# EAGLE schematic module (EAGLE 9.3.0)

## Sheet 1 of 5
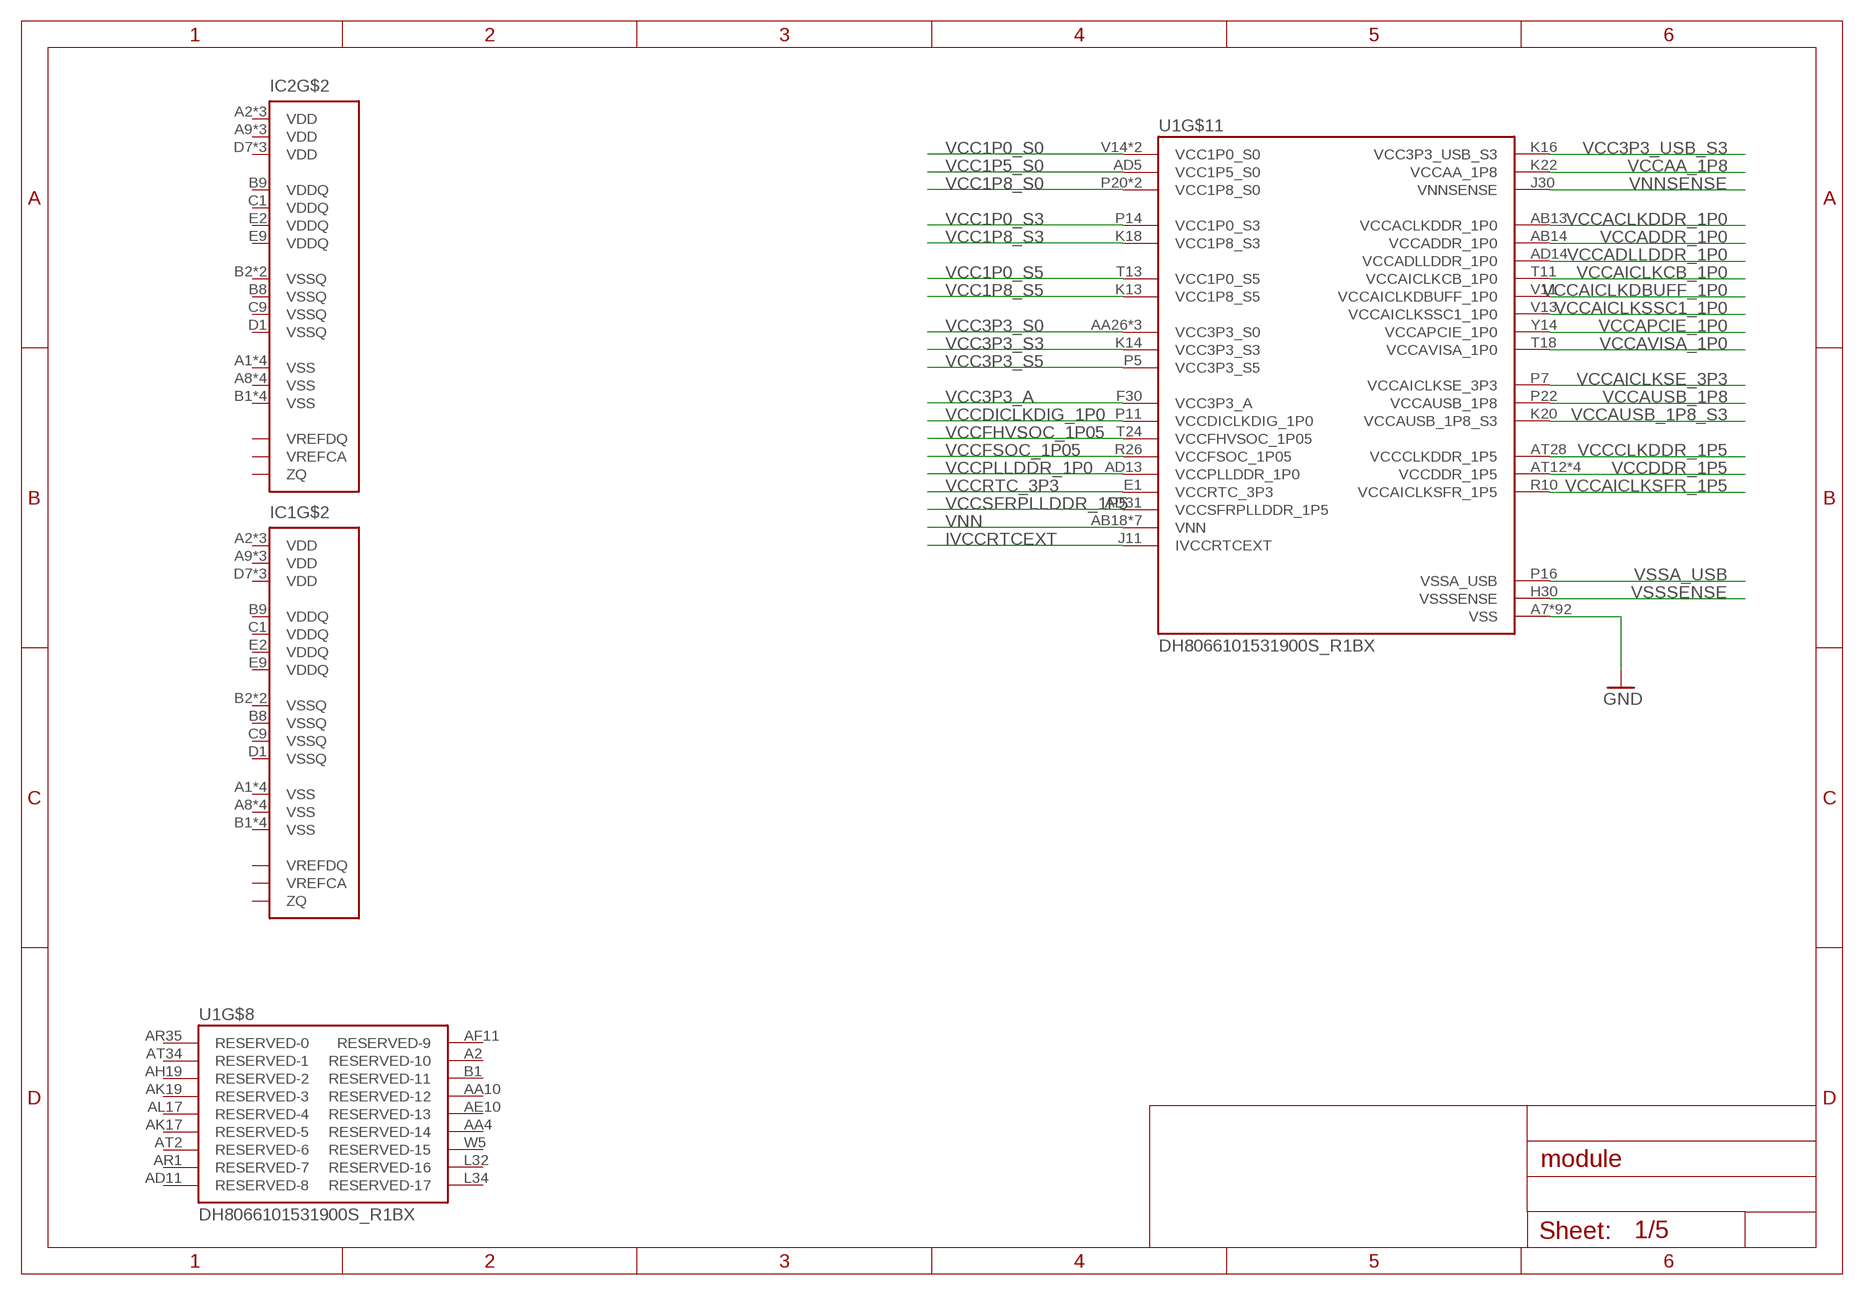
[diagram p0: schematic, sheet 1]

### Parts
IC1  IS43TR82560DL  [FBGA78]
IC2  IS43TR82560DL  [FBGA78]
U1  DH8066101531900S_R1BX  [INTEL_DH8066101531900S_R1BX]

### Nets
GND: U1.A7(VSS) U1.A10(VSS) U1.A12(VSS) U1.A14(VSS) U1.A16(VSS) U1.A18(VSS) U1.A23(VSS) U1.A28(VSS) U1.A31(VSS) U1.A32(VSS) U1.A34(VSS) U1.AB3(VSS) U1.AB11(VSS) U1.AB16(VSS) U1.AB35(VSS) U1.AC2(VSS) U1.AC9(VSS) U1.AC29(VSS) U1.AC30(VSS) U1.AD6(VSS) U1.AD8(VSS) U1.AD16(VSS) U1.AD18(VSS) U1.AD20(VSS) U1.AD35(VSS) U1.AE26(VSS) U1.AF13(VSS) U1.AF20(VSS) U1.AF22(VSS) U1.AF24(VSS) U1.AG1(VSS) U1.AG3(VSS) U1.AH11(VSS) U1.AH17(VSS) U1.AJ35(VSS) U1.AK15(VSS) U1.AK29(VSS) U1.AL6(VSS) U1.AL23(VSS) U1.AM1(VSS) U1.AM4(VSS) U1.AM7(VSS) U1.AM32(VSS) U1.AN9(VSS) U1.AN13(VSS) U1.AN27(VSS) U1.AP2(VSS) U1.AP18(VSS) U1.AP23(VSS) U1.AP33(VSS) U1.AT7(VSS) U1.B29(VSS) U1.B31(VSS) U1.B33(VSS) U1.B35(VSS) U1.C1(VSS) U1.C35(VSS) U1.D5(VSS) U1.D29(VSS) U1.D31(VSS) U1.D33(VSS) U1.E32(VSS) U1.E35(VSS) U1.F6(VSS) U1.F32(VSS) U1.G1(VSS) U1.G12(VSS) U1.H17(VSS) U1.J25(VSS) U1.K35(VSS) U1.M1(VSS) U1.M5(VSS) U1.M11(VSS) U1.M13(VSS) U1.M16(VSS) U1.M22(VSS) U1.M28(VSS) U1.P9(VSS) U1.P13(VSS) U1.P27(VSS) U1.T16(VSS) U1.T22(VSS) U1.U1(VSS) U1.U35(VSS) U1.V9(VSS) U1.V22(VSS) U1.V27(VSS) U1.W1(VSS) U1.W27(VSS) U1.Y11(VSS) U1.Y13(VSS) U1.Y22(VSS) ; also sheet 4,5
IVCCRTCEXT: U1.J11(IVCCRTCEXT)
VCC1P0_S0: U1.V14(VCC1P0_S0) U1.V16(VCC1P0_S0)
VCC1P0_S3: U1.P14(VCC1P0_S3)
VCC1P0_S5: U1.T13(VCC1P0_S5)
VCC1P5_S0: U1.AD5(VCC1P5_S0)
VCC1P8_S0: U1.P20(VCC1P8_S0) U1.T20(VCC1P8_S0)
VCC1P8_S3: U1.K18(VCC1P8_S3)
VCC1P8_S5: U1.K13(VCC1P8_S5)
VCC3P3_A: U1.F30(VCC3P3_A)
VCC3P3_S0: U1.AA26(VCC3P3_S0) U1.AB24(VCC3P3_S0) U1.AD24(VCC3P3_S0)
VCC3P3_S3: U1.K14(VCC3P3_S3)
VCC3P3_S5: U1.P5(VCC3P3_S5)
VCC3P3_USB_S3: U1.K16(VCC3P3_USB_S3)
VCCAA_1P8: U1.K22(VCCAA_1P8)
VCCACLKDDR_1P0: U1.AB13(VCCACLKDDR_1P0)
VCCADDR_1P0: U1.AB14(VCCADDR_1P0)
VCCADLLDDR_1P0: U1.AD14(VCCADLLDDR_1P0)
VCCAICLKCB_1P0: U1.T11(VCCAICLKCB_1P0)
VCCAICLKDBUFF_1P0: U1.V11(VCCAICLKDBUFF_1P0)
VCCAICLKSE_3P3: U1.P7(VCCAICLKSE_3P3)
VCCAICLKSFR_1P5: U1.R10(VCCAICLKSFR_1P5)
VCCAICLKSSC1_1P0: U1.V13(VCCAICLKSSC1_1P0)
VCCAPCIE_1P0: U1.Y14(VCCAPCIE_1P0)
VCCAUSB_1P8: U1.P22(VCCAUSB_1P8)
VCCAUSB_1P8_S3: U1.K20(VCCAUSB_1P8_S3)
VCCAVISA_1P0: U1.T18(VCCAVISA_1P0)
VCCCLKDDR_1P5: U1.AT28(VCCCLKDDR_1P5)
VCCDDR_1P5: U1.AT12(VCCDDR_1P5) U1.AT16(VCCDDR_1P5) U1.AT18(VCCDDR_1P5) U1.AT23(VCCDDR_1P5)
VCCDICLKDIG_1P0: U1.P11(VCCDICLKDIG_1P0)
VCCFHVSOC_1P05: U1.T24(VCCFHVSOC_1P05)
VCCFSOC_1P05: U1.R26(VCCFSOC_1P05)
VCCPLLDDR_1P0: U1.AD13(VCCPLLDDR_1P0)
VCCRTC_3P3: U1.E1(VCCRTC_3P3)
VCCSFRPLLDDR_1P5: U1.AD31(VCCSFRPLLDDR_1P5)
VNN: U1.AB18(VNN) U1.AB20(VNN) U1.V18(VNN) U1.V20(VNN) U1.Y16(VNN) U1.Y18(VNN) U1.Y20(VNN)
VNNSENSE: U1.J30(VNNSENSE)
VSSA_USB: U1.P16(VSSA_USB)
VSSSENSE: U1.H30(VSSSENSE)
Unconnected: IC1.E1(VREFDQ) IC1.H8(ZQ) IC1.J8(VREFCA) IC2.E1(VREFDQ) IC2.H8(ZQ) IC2.J8(VREFCA) U1.A2(RESERVED-10) U1.AA4(RESERVED-14) U1.AA10(RESERVED-12) U1.AD11(RESERVED-8) U1.AE10(RESERVED-13) U1.AF11(RESERVED-9) U1.AH19(RESERVED-2) U1.AK17(RESERVED-5) U1.AK19(RESERVED-3) U1.AL17(RESERVED-4) U1.AR1(RESERVED-7) U1.AR35(RESERVED-0) U1.AT2(RESERVED-6) U1.AT34(RESERVED-1) U1.B1(RESERVED-11) U1.L32(RESERVED-16) U1.L34(RESERVED-17) U1.W5(RESERVED-15)

## Sheet 2 of 5
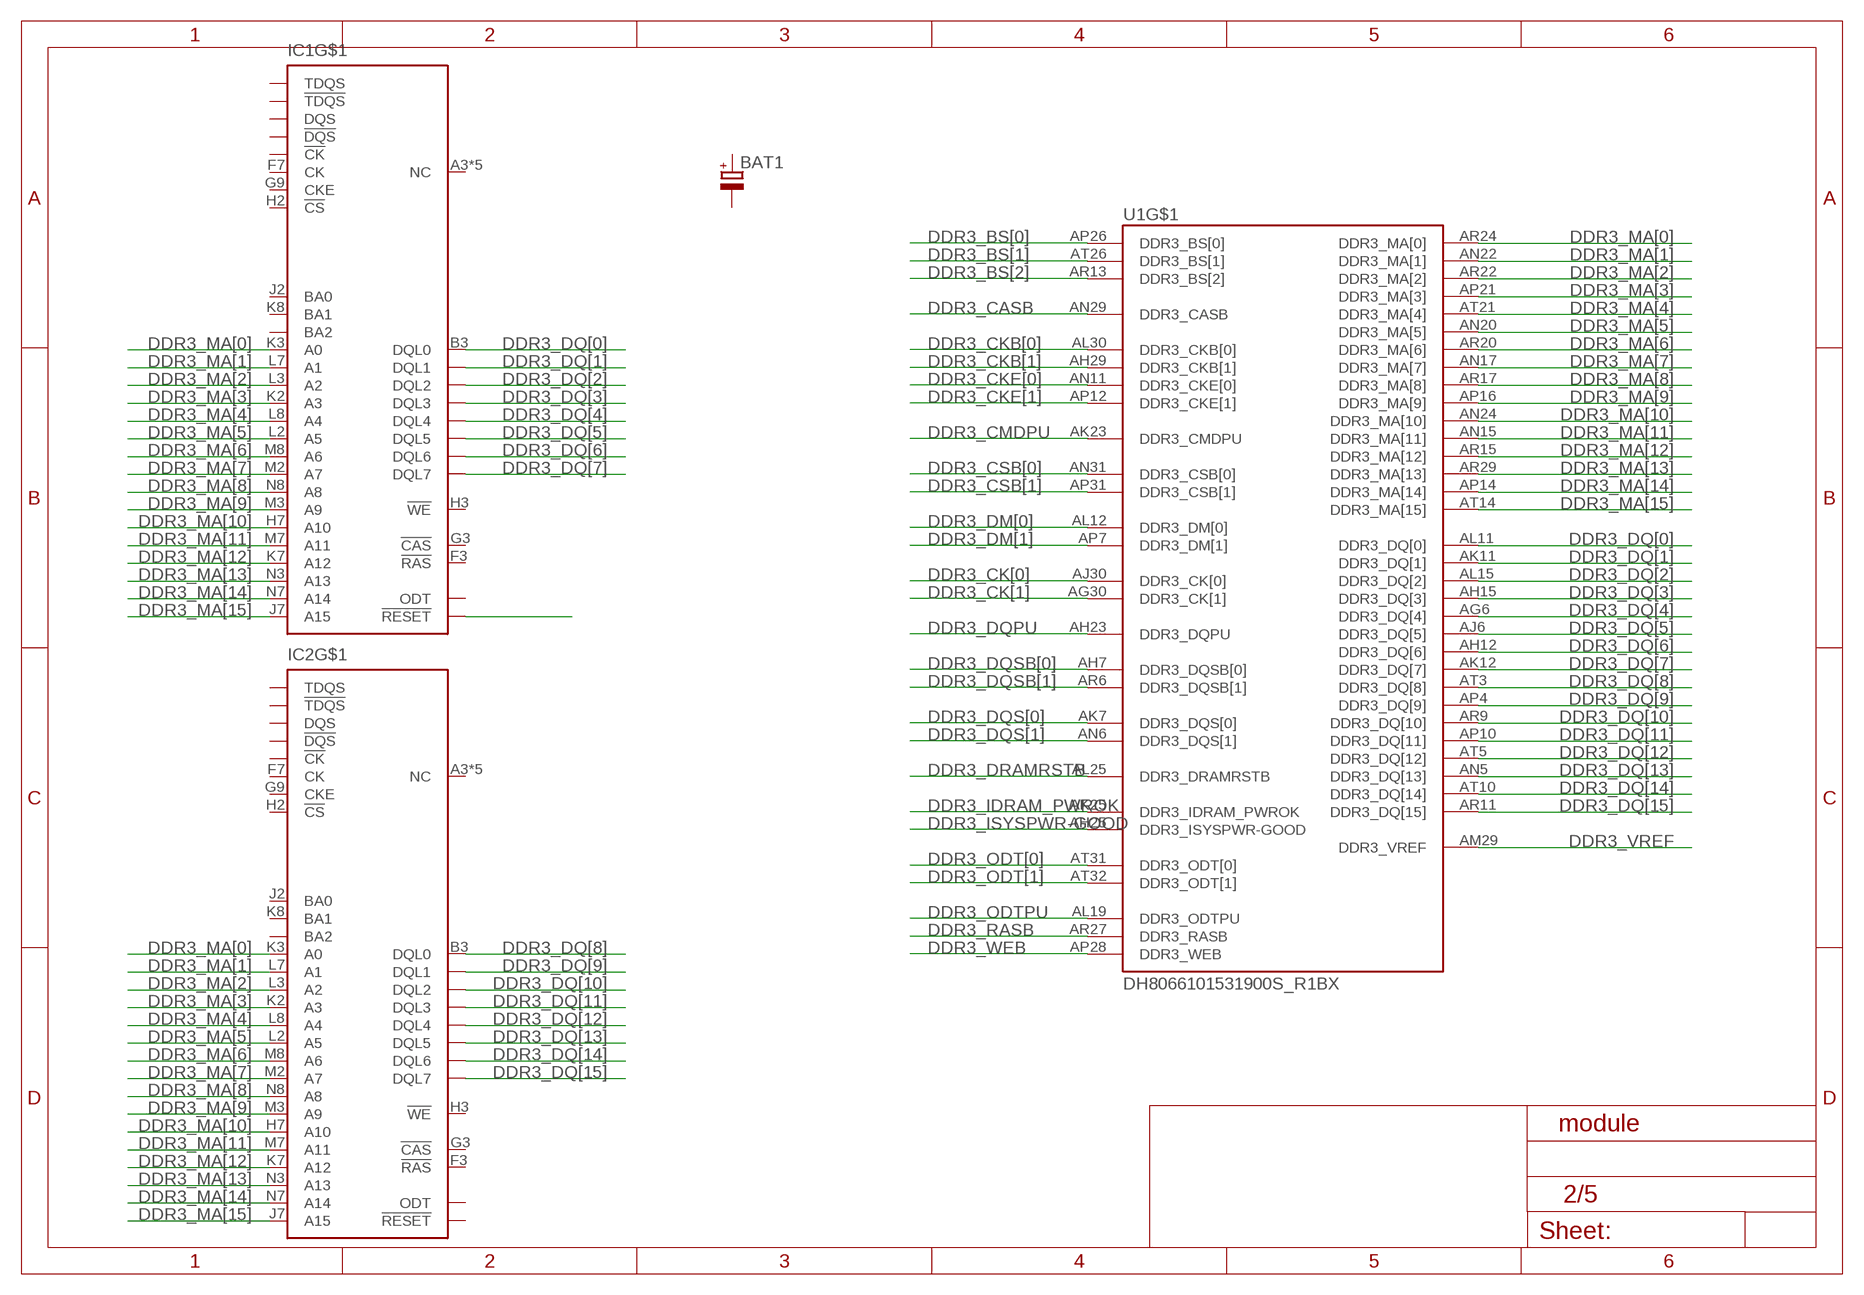
[diagram p1: schematic, sheet 2]

### Parts
BAT1  DCK-3R3E224U-E  [621]

### Nets
DDR3_BS[0]: U1.AP26(DDR3_BS[0])
DDR3_BS[1]: U1.AT26(DDR3_BS[1])
DDR3_BS[2]: U1.AR13(DDR3_BS[2])
DDR3_CASB: U1.AN29(DDR3_CASB)
DDR3_CK[0]: U1.AJ30(DDR3_CK[0])
DDR3_CK[1]: U1.AG30(DDR3_CK[1])
DDR3_CKB[0]: U1.AL30(DDR3_CKB[0])
DDR3_CKB[1]: U1.AH29(DDR3_CKB[1])
DDR3_CKE[0]: U1.AN11(DDR3_CKE[0])
DDR3_CKE[1]: U1.AP12(DDR3_CKE[1])
DDR3_CMDPU: U1.AK23(DDR3_CMDPU)
DDR3_CSB[0]: U1.AN31(DDR3_CSB[0])
DDR3_CSB[1]: U1.AP31(DDR3_CSB[1])
DDR3_DM[0]: U1.AL12(DDR3_DM[0])
DDR3_DM[1]: U1.AP7(DDR3_DM[1])
DDR3_DQ[0]: IC1.B3(DQL0) U1.AL11(DDR3_DQ[0])
DDR3_DQ[1]: IC1.C7(DQL1) U1.AK11(DDR3_DQ[1])
DDR3_DQ[2]: IC1.C2(DQL2) U1.AL15(DDR3_DQ[2])
DDR3_DQ[3]: IC1.C8(DQL3) U1.AH15(DDR3_DQ[3])
DDR3_DQ[4]: IC1.E3(DQL4) U1.AG6(DDR3_DQ[4])
DDR3_DQ[5]: IC1.E8(DQL5) U1.AJ6(DDR3_DQ[5])
DDR3_DQ[6]: IC1.D2(DQL6) U1.AH12(DDR3_DQ[6])
DDR3_DQ[7]: IC1.E7(DQL7) U1.AK12(DDR3_DQ[7])
DDR3_DQ[8]: IC2.B3(DQL0) U1.AT3(DDR3_DQ[8])
DDR3_DQ[9]: IC2.C7(DQL1) U1.AP4(DDR3_DQ[9])
DDR3_DQ[10]: IC2.C2(DQL2) U1.AR9(DDR3_DQ[10])
DDR3_DQ[11]: IC2.C8(DQL3) U1.AP10(DDR3_DQ[11])
DDR3_DQ[12]: IC2.E3(DQL4) U1.AT5(DDR3_DQ[12])
DDR3_DQ[13]: IC2.E8(DQL5) U1.AN5(DDR3_DQ[13])
DDR3_DQ[14]: IC2.D2(DQL6) U1.AT10(DDR3_DQ[14])
DDR3_DQ[15]: IC2.E7(DQL7) U1.AR11(DDR3_DQ[15])
DDR3_DQPU: U1.AH23(DDR3_DQPU)
DDR3_DQS[0]: U1.AK7(DDR3_DQS[0])
DDR3_DQS[1]: U1.AN6(DDR3_DQS[1])
DDR3_DQSB[0]: U1.AH7(DDR3_DQSB[0])
DDR3_DQSB[1]: U1.AR6(DDR3_DQSB[1])
DDR3_DRAMRSTB: U1.AL25(DDR3_DRAMRSTB)
DDR3_IDRAM_PWROK: U1.AK25(DDR3_IDRAM_PWROK)
DDR3_ISYSPWR-GOOD: U1.AH25(DDR3_ISYSPWR-GOOD)
DDR3_MA[0]: IC1.K3(A0) IC2.K3(A0) U1.AR24(DDR3_MA[0])
DDR3_MA[1]: IC1.L7(A1) IC2.L7(A1) U1.AN22(DDR3_MA[1])
DDR3_MA[2]: IC1.L3(A2) IC2.L3(A2) U1.AR22(DDR3_MA[2])
DDR3_MA[3]: IC1.K2(A3) IC2.K2(A3) U1.AP21(DDR3_MA[3])
DDR3_MA[4]: IC1.L8(A4) IC2.L8(A4) U1.AT21(DDR3_MA[4])
DDR3_MA[5]: IC1.L2(A5) IC2.L2(A5) U1.AN20(DDR3_MA[5])
DDR3_MA[6]: IC1.M8(A6) IC2.M8(A6) U1.AR20(DDR3_MA[6])
DDR3_MA[7]: IC1.M2(A7) IC2.M2(A7) U1.AN17(DDR3_MA[7])
DDR3_MA[8]: IC1.N8(A8) IC2.N8(A8) U1.AR17(DDR3_MA[8])
DDR3_MA[9]: IC1.M3(A9) IC2.M3(A9) U1.AP16(DDR3_MA[9])
DDR3_MA[10]: IC1.H7(A10) IC2.H7(A10) U1.AN24(DDR3_MA[10])
DDR3_MA[11]: IC1.M7(A11) IC2.M7(A11) U1.AN15(DDR3_MA[11])
DDR3_MA[12]: IC1.K7(A12) IC2.K7(A12) U1.AR15(DDR3_MA[12])
DDR3_MA[13]: IC1.N3(A13) IC2.N3(A13) U1.AR29(DDR3_MA[13])
DDR3_MA[14]: IC1.N7(A14) IC2.N7(A14) U1.AP14(DDR3_MA[14])
DDR3_MA[15]: IC1.J7(A15) IC2.J7(A15) U1.AT14(DDR3_MA[15])
DDR3_ODT[0]: U1.AT31(DDR3_ODT[0])
DDR3_ODT[1]: U1.AT32(DDR3_ODT[1])
DDR3_ODTPU: U1.AL19(DDR3_ODTPU)
DDR3_RASB: U1.AR27(DDR3_RASB)
DDR3_VREF: U1.AM29(DDR3_VREF)
DDR3_WEB: U1.AP28(DDR3_WEB)
N$1: IC1.N2(!RESET)
Unconnected: BAT1.+ BAT1.- IC1.A3(NC) IC1.A7(!TDQS) IC1.B7(TDQS) IC1.C3(DQS) IC1.D3(!DQS) IC1.F1(NC) IC1.F3(!RAS) IC1.F7(CK) IC1.F9(NC) IC1.G1(ODT) IC1.G3(!CAS) IC1.G7(!CK) IC1.G9(CKE) IC1.H1(NC) IC1.H2(!CS) IC1.H3(!WE) IC1.H9(NC) IC1.J2(BA0) IC1.J3(BA2) IC1.K8(BA1) IC2.A3(NC) IC2.A7(!TDQS) IC2.B7(TDQS) IC2.C3(DQS) IC2.D3(!DQS) IC2.F1(NC) IC2.F3(!RAS) IC2.F7(CK) IC2.F9(NC) IC2.G1(ODT) IC2.G3(!CAS) IC2.G7(!CK) IC2.G9(CKE) IC2.H1(NC) IC2.H2(!CS) IC2.H3(!WE) IC2.H9(NC) IC2.J2(BA0) IC2.J3(BA2) IC2.K8(BA1) IC2.N2(!RESET)

## Sheet 3 of 5
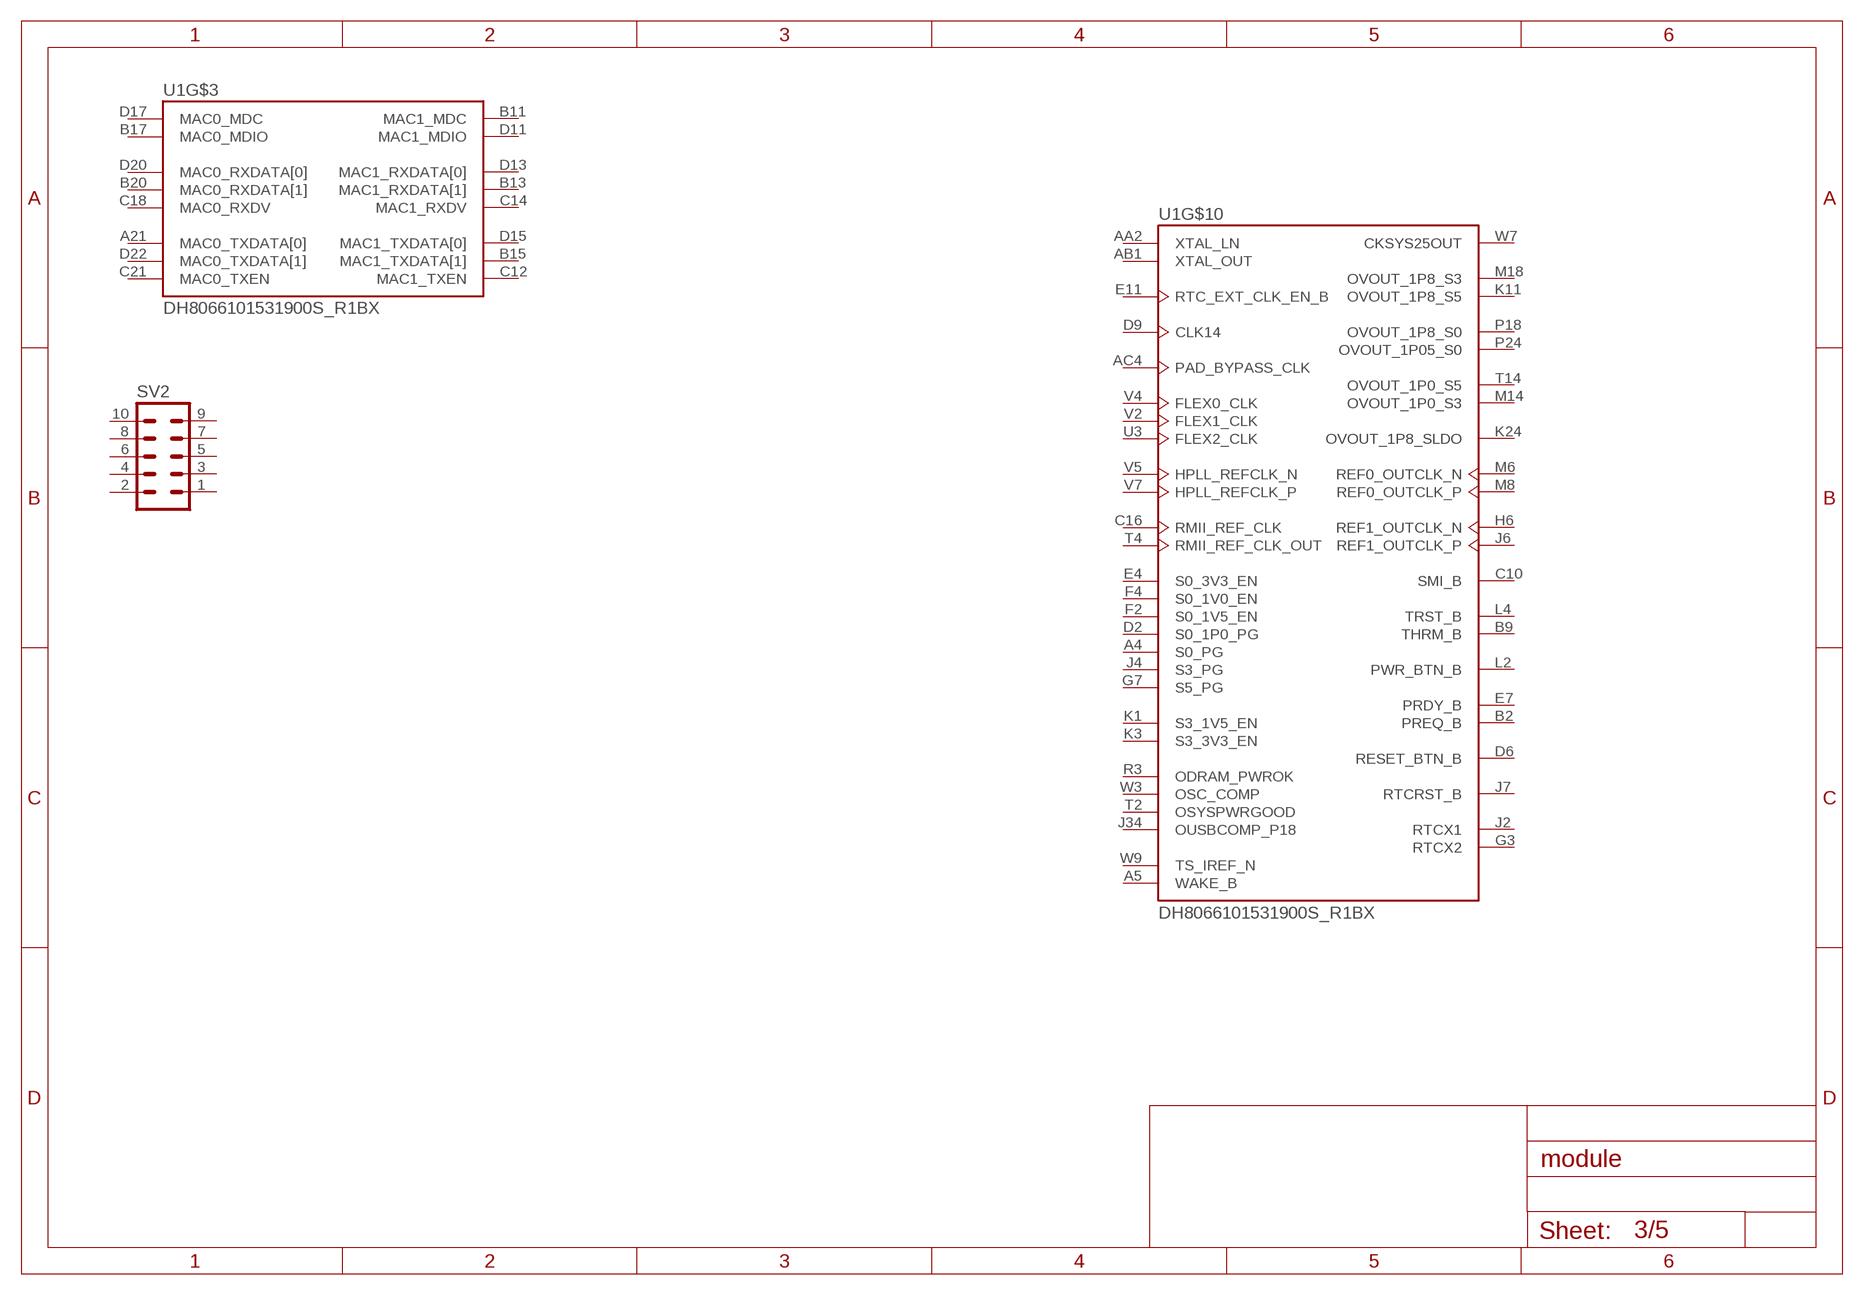
[diagram p2: schematic, sheet 3]

### Parts
SV2  MA05-2  [MA05-2]
Unconnected: SV2.1 SV2.2 SV2.3 SV2.4 SV2.5 SV2.6 SV2.7 SV2.8 SV2.9 SV2.10 U1.A4(S0_PG) U1.A5(WAKE_B) U1.A21(MAC0_TXDATA[0]) U1.AA2(XTAL_LN) U1.AB1(XTAL_OUT) U1.AC4(PAD_BYPASS_CLK) U1.B2(PREQ_B) U1.B9(THRM_B) U1.B11(MAC1_MDC) U1.B13(MAC1_RXDATA[1]) U1.B15(MAC1_TXDATA[1]) U1.B17(MAC0_MDIO) U1.B20(MAC0_RXDATA[1]) U1.C10(SMI_B) U1.C12(MAC1_TXEN) U1.C14(MAC1_RXDV) U1.C16(RMII_REF_CLK) U1.C18(MAC0_RXDV) U1.C21(MAC0_TXEN) U1.D2(S0_1P0_PG) U1.D6(RESET_BTN_B) U1.D9(CLK14) U1.D11(MAC1_MDIO) U1.D13(MAC1_RXDATA[0]) U1.D15(MAC1_TXDATA[0]) U1.D17(MAC0_MDC) U1.D20(MAC0_RXDATA[0]) U1.D22(MAC0_TXDATA[1]) U1.E4(S0_3V3_EN) U1.E7(PRDY_B) U1.E11(RTC_EXT_CLK_EN_B) U1.F2(S0_1V5_EN) U1.F4(S0_1V0_EN) U1.G3(RTCX2) U1.G7(S5_PG) U1.H6(REF1_OUTCLK_N) U1.J2(RTCX1) U1.J4(S3_PG) U1.J6(REF1_OUTCLK_P) U1.J7(RTCRST_B) U1.J34(OUSBCOMP_P18) U1.K1(S3_1V5_EN) U1.K3(S3_3V3_EN) U1.K11(OVOUT_1P8_S5) U1.K24(OVOUT_1P8_SLDO) U1.L2(PWR_BTN_B) U1.L4(TRST_B) U1.M6(REF0_OUTCLK_N) U1.M8(REF0_OUTCLK_P) U1.M14(OVOUT_1P0_S3) U1.M18(OVOUT_1P8_S3) U1.P18(OVOUT_1P8_S0) U1.P24(OVOUT_1P05_S0) U1.R3(ODRAM_PWROK) U1.T2(OSYSPWRGOOD) U1.T4(RMII_REF_CLK_OUT) U1.T14(OVOUT_1P0_S5) U1.U3(FLEX2_CLK) U1.V2(FLEX1_CLK) U1.V4(FLEX0_CLK) U1.V5(HPLL_REFCLK_N) U1.V7(HPLL_REFCLK_P) U1.W3(OSC_COMP) U1.W7(CKSYS25OUT) U1.W9(TS_IREF_N)

## Sheet 4 of 5
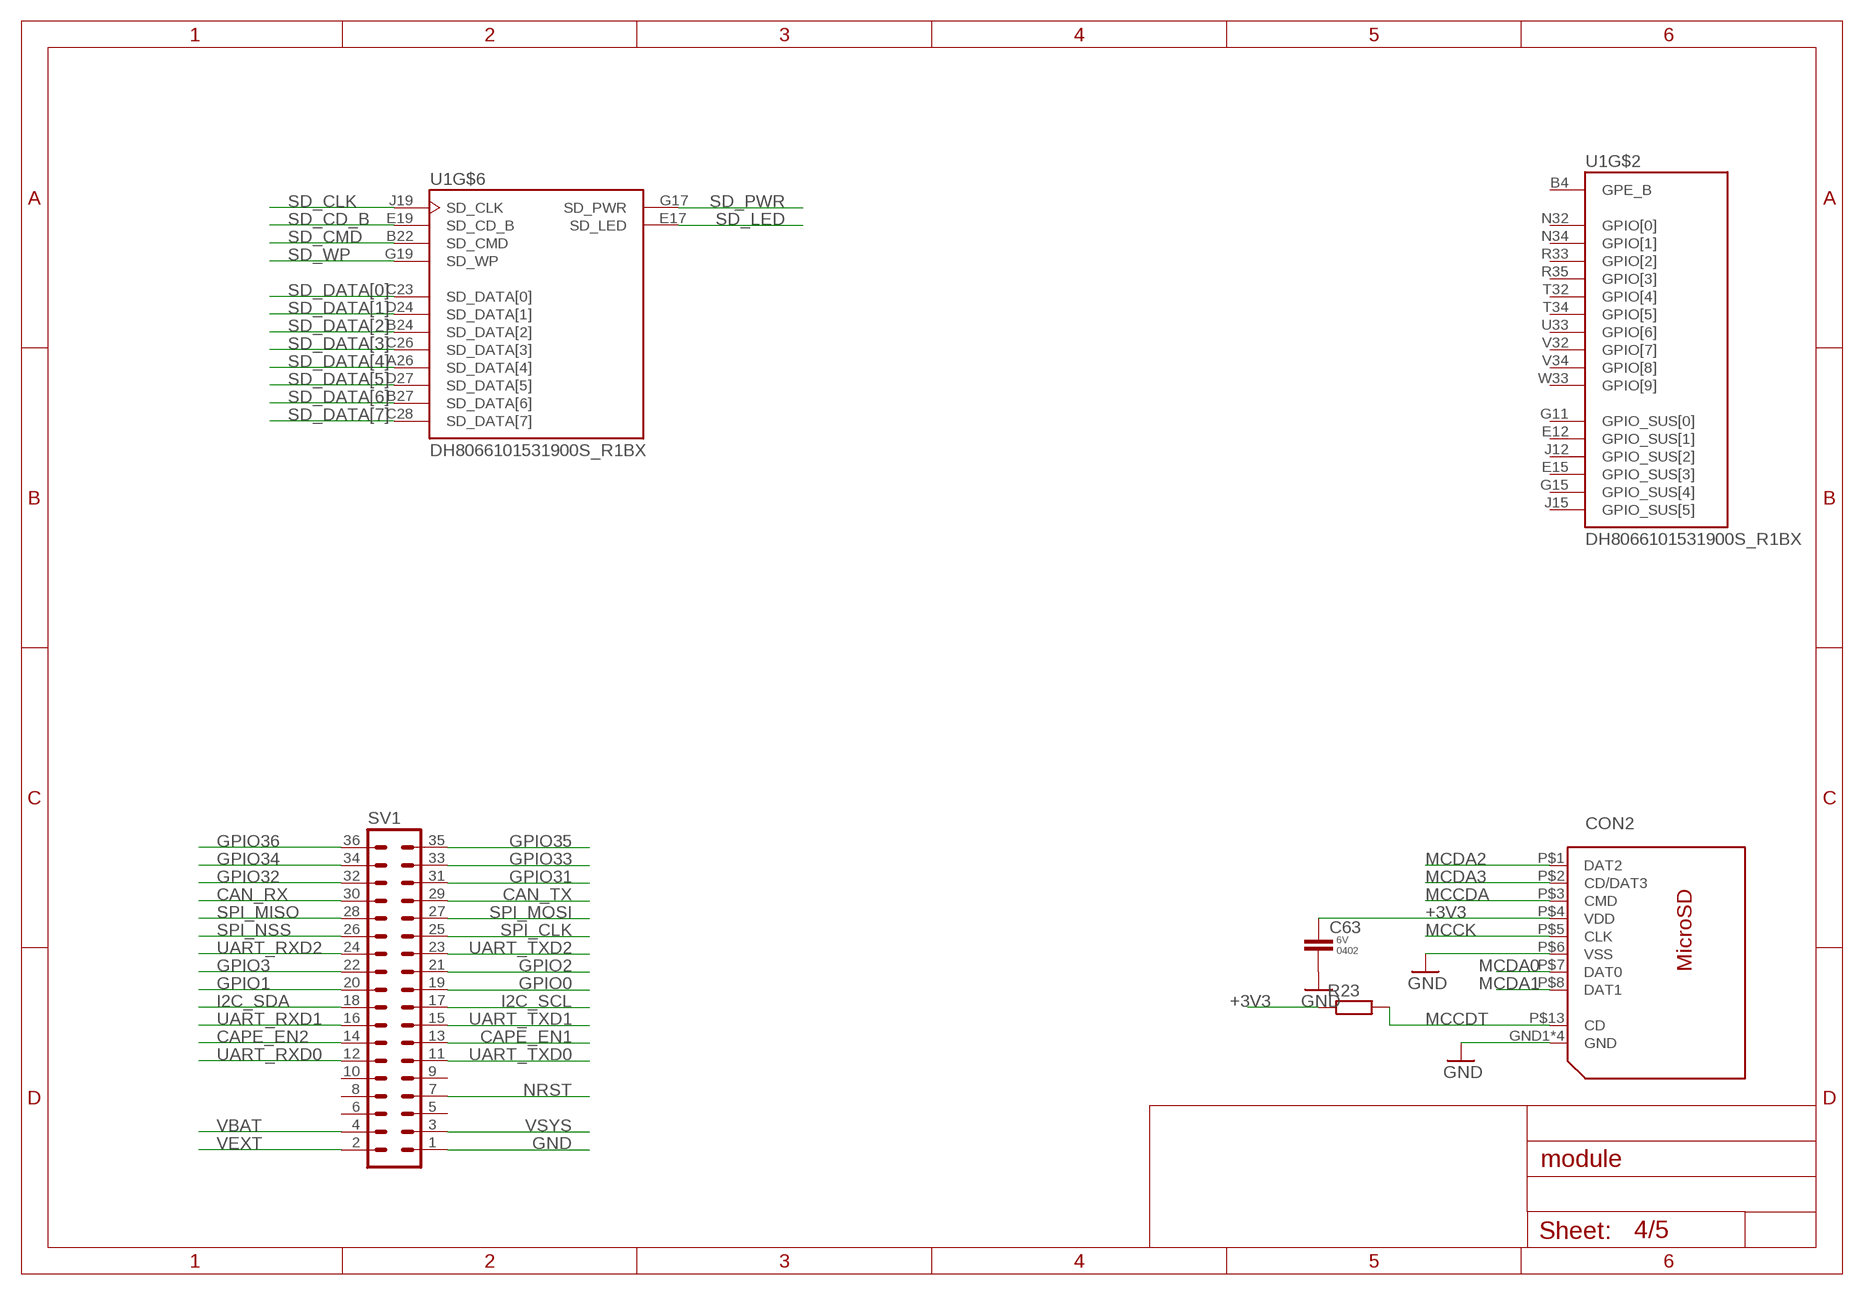
[diagram p3: schematic, sheet 4]

### Parts
C63  CAP-0402  [C0402K]
CON2  112J-TXAR  [112J]
R23  R-EU_R0402  [R0402]
SV1  MA18-2  [MA18-2]

### Nets
+3V3: C63.1 CON2.P$4(VDD) R23.1
CAN_RX: SV1.30
CAN_TX: SV1.29
CAPE_EN1: SV1.13
CAPE_EN2: SV1.14
GND: C63.2 CON2.GND1(GND) CON2.GND2(GND) CON2.GND3(GND) CON2.GND4(GND) CON2.P$6(VSS) SV1.1 ; also sheet 1,5
GPIO0: SV1.19
GPIO1: SV1.20
GPIO2: SV1.21
GPIO3: SV1.22
GPIO31: SV1.31
GPIO32: SV1.32
GPIO33: SV1.33
GPIO34: SV1.34
GPIO35: SV1.35
GPIO36: SV1.36
I2C_SCL: SV1.17
I2C_SDA: SV1.18
MCCDA: CON2.P$3(CMD)
MCCDT: CON2.P$13(CD) R23.2
MCCK: CON2.P$5(CLK)
MCDA0: CON2.P$7(DAT0)
MCDA1: CON2.P$8(DAT1)
MCDA2: CON2.P$1(DAT2)
MCDA3: CON2.P$2(CD/DAT3)
NRST: SV1.7
SD_CD_B: U1.E19(SD_CD_B)
SD_CLK: U1.J19(SD_CLK)
SD_CMD: U1.B22(SD_CMD)
SD_DATA[0]: U1.C23(SD_DATA[0])
SD_DATA[1]: U1.D24(SD_DATA[1])
SD_DATA[2]: U1.B24(SD_DATA[2])
SD_DATA[3]: U1.C26(SD_DATA[3])
SD_DATA[4]: U1.A26(SD_DATA[4])
SD_DATA[5]: U1.D27(SD_DATA[5])
SD_DATA[6]: U1.B27(SD_DATA[6])
SD_DATA[7]: U1.C28(SD_DATA[7])
SD_LED: U1.E17(SD_LED)
SD_PWR: U1.G17(SD_PWR)
SD_WP: U1.G19(SD_WP)
SPI_CLK: SV1.25
SPI_MISO: SV1.28
SPI_MOSI: SV1.27
SPI_NSS: SV1.26
UART_RXD0: SV1.12
UART_RXD1: SV1.16
UART_RXD2: SV1.24
UART_TXD0: SV1.11
UART_TXD1: SV1.15
UART_TXD2: SV1.23
VBAT: SV1.4
VEXT: SV1.2
VSYS: SV1.3
Unconnected: SV1.5 SV1.6 SV1.8 SV1.9 SV1.10 U1.B4(GPE_B) U1.E12(GPIO_SUS[1]) U1.E15(GPIO_SUS[3]) U1.G11(GPIO_SUS[0]) U1.G15(GPIO_SUS[4]) U1.J12(GPIO_SUS[2]) U1.J15(GPIO_SUS[5]) U1.N32(GPIO[0]) U1.N34(GPIO[1]) U1.R33(GPIO[2]) U1.R35(GPIO[3]) U1.T32(GPIO[4]) U1.T34(GPIO[5]) U1.U33(GPIO[6]) U1.V32(GPIO[7]) U1.V34(GPIO[8]) U1.W33(GPIO[9])

## Sheet 5 of 5
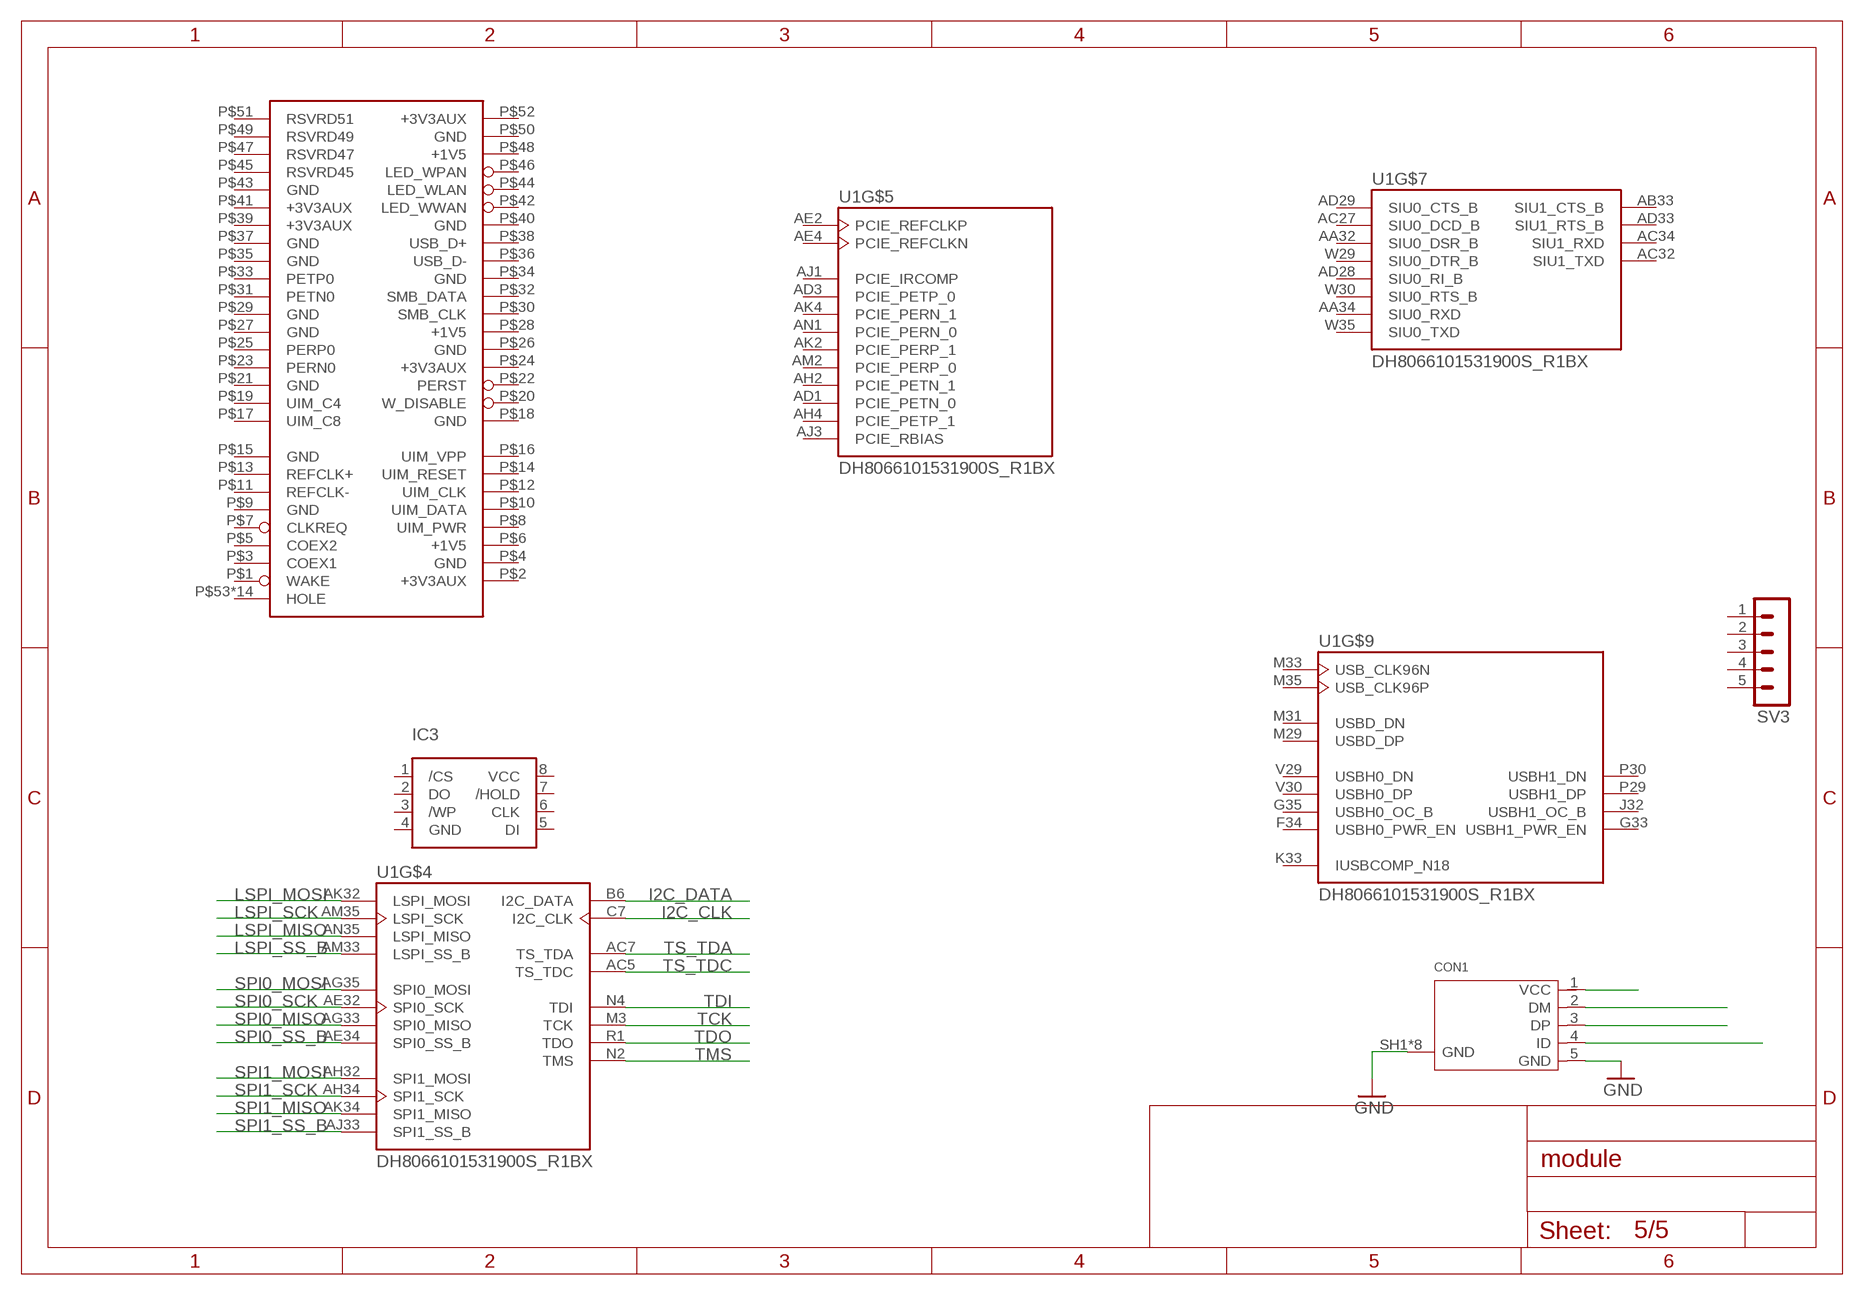
[diagram p4: schematic, sheet 5]

### Parts
CON1  10118194-0001LF  [10118194]
IC3  W25Q128JV  [SO08-208]
PCI1  119A-XXA00  [119A]
SV3  MA05-1  [MA05-1]

### Nets
GND: CON1.5(GND) CON1.SH1(GND) CON1.SH2(GND) CON1.SH3(GND) CON1.SH4(GND) CON1.SH5(GND) CON1.SH6(GND) CON1.SH7(GND) CON1.SH8(GND) ; also sheet 1,4
I2C_CLK: U1.C7(I2C_CLK)
I2C_DATA: U1.B6(I2C_DATA)
LSPI_MISO: U1.AN35(LSPI_MISO)
LSPI_MOSI: U1.AK32(LSPI_MOSI)
LSPI_SCK: U1.AM35(LSPI_SCK)
LSPI_SS_B: U1.AM33(LSPI_SS_B)
N$4: CON1.1(VCC)
SPI0_MISO: U1.AG33(SPI0_MISO)
SPI0_MOSI: U1.AG35(SPI0_MOSI)
SPI0_SCK: U1.AE32(SPI0_SCK)
SPI0_SS_B: U1.AE34(SPI0_SS_B)
SPI1_MISO: U1.AK34(SPI1_MISO)
SPI1_MOSI: U1.AH32(SPI1_MOSI)
SPI1_SCK: U1.AH34(SPI1_SCK)
SPI1_SS_B: U1.AJ33(SPI1_SS_B)
TCK: U1.M3(TCK)
TDI: U1.N4(TDI)
TDO: U1.R1(TDO)
TMS: U1.N2(TMS)
TS_TDA: U1.AC7(TS_TDA)
TS_TDC: U1.AC5(TS_TDC)
USBC_DM: CON1.2(DM)
USBC_DP: CON1.3(DP)
USBC_ID: CON1.4(ID)
Unconnected: IC3.1(/CS) IC3.2(DO) IC3.3(/WP) IC3.4(GND) IC3.5(DI) IC3.6(CLK) IC3.7(/HOLD) IC3.8(VCC) PCI1.P$1(WAKE) PCI1.P$3(COEX1) PCI1.P$5(COEX2) PCI1.P$7(CLKREQ) PCI1.P$8(UIM_PWR) PCI1.P$10(UIM_DATA) PCI1.P$11(REFCLK-) PCI1.P$12(UIM_CLK) PCI1.P$13(REFCLK+) PCI1.P$14(UIM_RESET) PCI1.P$16(UIM_VPP) PCI1.P$17(UIM_C8) PCI1.P$19(UIM_C4) PCI1.P$20(W_DISABLE) PCI1.P$22(PERST) PCI1.P$23(PERN0) PCI1.P$25(PERP0) PCI1.P$30(SMB_CLK) PCI1.P$31(PETN0) PCI1.P$33(PETP0) PCI1.P$34(GND) PCI1.P$36(USB_D-) PCI1.P$37(GND) PCI1.P$39(+3V3AUX) PCI1.P$40(GND) PCI1.P$41(+3V3AUX) PCI1.P$42(LED_WWAN) PCI1.P$43(GND) PCI1.P$44(LED_WLAN) PCI1.P$45(RSVRD45) PCI1.P$46(LED_WPAN) PCI1.P$47(RSVRD47) PCI1.P$48(+1V5) PCI1.P$49(RSVRD49) PCI1.P$50(GND) PCI1.P$51(RSVRD51) PCI1.P$53(HOLE) PCI1.P$54(HOLE) PCI1.P$55(HOLE) PCI1.P$56(HOLE) PCI1.P$57(HOLE) PCI1.P$58(HOLE) PCI1.P$59(HOLE) PCI1.P$60(HOLE) PCI1.P$61(HOLE) PCI1.P$62(HOLE) PCI1.P$63(HOLE) PCI1.P$64(HOLE) PCI1.P$65(HOLE) PCI1.P$66(HOLE) SV3.1 SV3.2 SV3.3 SV3.4 SV3.5 U1.AA32(SIU0_DSR_B) U1.AA34(SIU0_RXD) U1.AB33(SIU1_CTS_B) U1.AC27(SIU0_DCD_B) U1.AC32(SIU1_TXD) U1.AC34(SIU1_RXD) U1.AD1(PCIE_PETN_0) U1.AD3(PCIE_PETP_0) U1.AD28(SIU0_RI_B) U1.AD29(SIU0_CTS_B) U1.AD33(SIU1_RTS_B) U1.AE2(PCIE_REFCLKP) U1.AE4(PCIE_REFCLKN) U1.AH2(PCIE_PETN_1) U1.AH4(PCIE_PETP_1) U1.AJ1(PCIE_IRCOMP) U1.AJ3(PCIE_RBIAS) U1.AK2(PCIE_PERP_1) U1.AK4(PCIE_PERN_1) U1.AM2(PCIE_PERP_0) U1.AN1(PCIE_PERN_0) U1.F34(USBH0_PWR_EN) U1.G33(USBH1_PWR_EN) U1.G35(USBH0_OC_B) U1.J32(USBH1_OC_B) U1.K33(IUSBCOMP_N18) U1.M29(USBD_DP) U1.M31(USBD_DN) U1.M33(USB_CLK96N) U1.M35(USB_CLK96P) U1.P29(USBH1_DP) U1.P30(USBH1_DN) U1.V29(USBH0_DN) U1.V30(USBH0_DP) U1.W29(SIU0_DTR_B) U1.W30(SIU0_RTS_B) U1.W35(SIU0_TXD)

## Power pins joined to a net without a drawn wire
+1V5: PCI1.P$6(+1V5) PCI1.P$28(+1V5)
+3V3AUX: PCI1.P$2(+3V3AUX) PCI1.P$24(+3V3AUX) PCI1.P$52(+3V3AUX)
GND: PCI1.P$4(GND) PCI1.P$9(GND) PCI1.P$15(GND) PCI1.P$18(GND) PCI1.P$21(GND) PCI1.P$26(GND) PCI1.P$27(GND) PCI1.P$29(GND) PCI1.P$35(GND)
SMB_DATA: PCI1.P$32(SMB_DATA)
USB_D+: PCI1.P$38(USB_D+)
VDD: IC1.A2(VDD) IC1.A9(VDD) IC1.D7(VDD) IC1.G2(VDD) IC1.G8(VDD) IC1.K1(VDD) IC1.K9(VDD) IC1.M1(VDD) IC1.M9(VDD) IC2.A2(VDD) IC2.A9(VDD) IC2.D7(VDD) IC2.G2(VDD) IC2.G8(VDD) IC2.K1(VDD) IC2.K9(VDD) IC2.M1(VDD) IC2.M9(VDD)
VDDQ: IC1.B9(VDDQ) IC1.C1(VDDQ) IC1.E2(VDDQ) IC1.E9(VDDQ) IC2.B9(VDDQ) IC2.C1(VDDQ) IC2.E2(VDDQ) IC2.E9(VDDQ)
VSS: IC1.A1(VSS) IC1.A8(VSS) IC1.B1(VSS) IC1.D8(VSS) IC1.F2(VSS) IC1.F8(VSS) IC1.J1(VSS) IC1.J9(VSS) IC1.L1(VSS) IC1.L9(VSS) IC1.N1(VSS) IC1.N9(VSS) IC2.A1(VSS) IC2.A8(VSS) IC2.B1(VSS) IC2.D8(VSS) IC2.F2(VSS) IC2.F8(VSS) IC2.J1(VSS) IC2.J9(VSS) IC2.L1(VSS) IC2.L9(VSS) IC2.N1(VSS) IC2.N9(VSS)
VSSQ: IC1.B2(VSSQ) IC1.B8(VSSQ) IC1.C9(VSSQ) IC1.D1(VSSQ) IC1.D9(VSSQ) IC2.B2(VSSQ) IC2.B8(VSSQ) IC2.C9(VSSQ) IC2.D1(VSSQ) IC2.D9(VSSQ)

## Library data of the parts
BAT1 = parts-elna:DCK-3R3E224U-E
C63 = parts-passives:CAP-; PACKAGE: 0402; RATING: 6V
CON1 = parts-amphenol:10118194-00
CON2 = parts-attend:112J-TXAR
IC1 IC2 = parts-issi:IS43TR82560DL
IC3 = parts-winbond:W25Q128JV
PCI1 = parts-attend:119A-XXA00
R23 = rcl:R-EU_: RESISTOR, European symbol; SPICEPREFIX: R
SV1 = con-lstb:MA18-2: PIN HEADER; OC_FARNELL: unknown; OC_NEWARK: unknown
SV2 = con-lstb:MA05-2: PIN HEADER; OC_FARNELL: unknown; OC_NEWARK: unknown
SV3 = con-lstb:MA05-1: PIN HEADER; OC_FARNELL: unknown; OC_NEWARK: unknown
U1 = DH8066101531900S_R1BX:DH8066101531900S_R1BX: MPU Quark 32-Bit 400MHz 393-Pin FCBGA Tray; AVAILABILITY: Unavailable; DESCRIPTION: MPU Quark 32-Bit 400MHz 393-Pin FCBGA Tray; MF: Intel; MP: DH8066101531900S R1BX; PACKAGE: FCBGA-393 Intel; PRICE: None